# Altium schematic sheet top.SchDoc
size A4
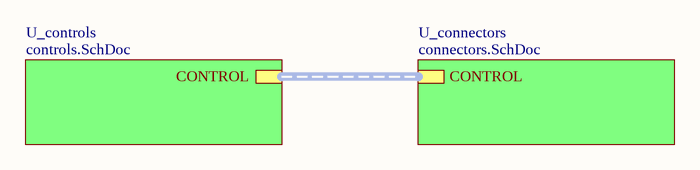
[diagram p0: top.SchDoc]

## Sub-sheets
U_connectors = connectors.SchDoc: CONTROL (harness CONTROL)
U_controls = controls.SchDoc: CONTROL (harness CONTROL)

## Buses and harness runs
harness sheet U_connectors/CONTROL = sheet U_controls/CONTROL